# Altium schematic sheet peripherals.SchDoc: Arduino_Peripherals
size A4; DocumentNumber: 3; SheetNumber: 3; SheetTotal: 3
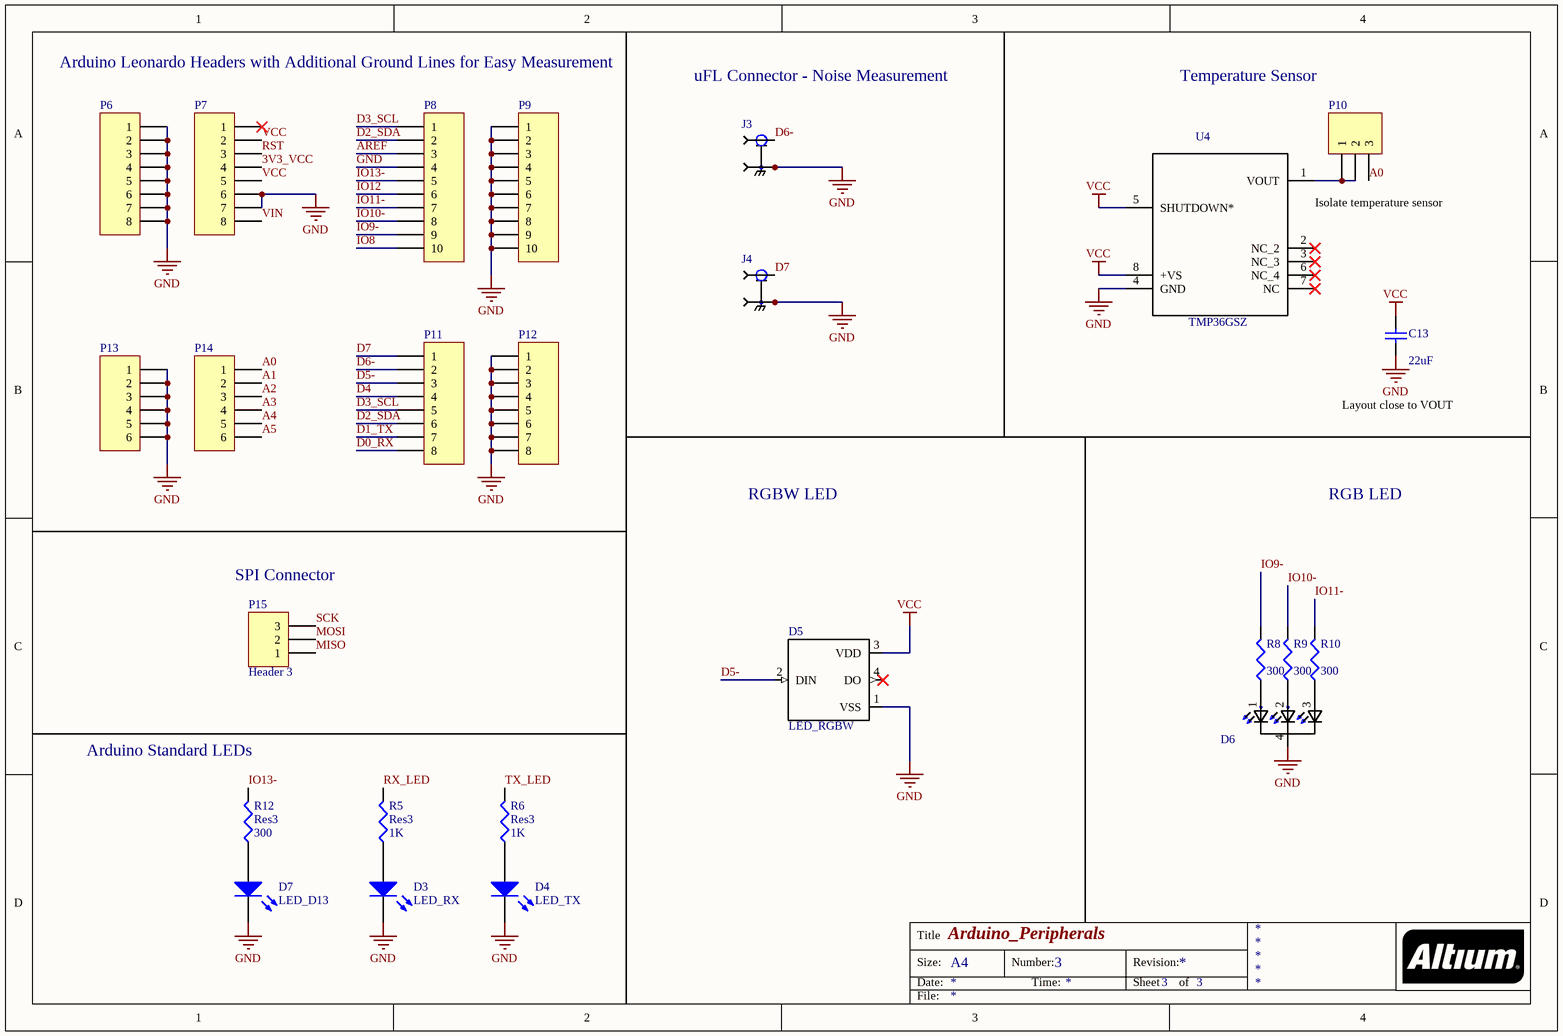
[diagram p0: peripherals.SchDoc]

## Parts
C13  value 22uF  [C1206]  (hidden comment: Cap Semi)
D3  LED_RX  [3.2X1.6X1.1]
D4  LED_TX  [3.2X1.6X1.1]
D5  LED_RGBW  [*LED_IN-PI554FCH]
D6  LED_RGB  [*LED_ASMB-KTF0-0A306]  (value not drawn)
D7  LED_D13  [3.2X1.6X1.1]
J3  U.FL-R-SMT(10)  [*TE_HRS_U.FL-R-SMT(10)]  (value not drawn)
J4  U.FL-R-SMT(10)  [*TE_HRS_U.FL-R-SMT(10)]  (value not drawn)
P6  GND  [HDR1X8]  (value not drawn)
P7  P4  [HDR1X8]  (value not drawn)
P8  P1  [HDR1X10]  (value not drawn)
P9  GND  [HDR1X10]  (value not drawn)
P10  NC A0  [HDR1X3]  (value not drawn)
P11  P2  [HDR1X8]  (value not drawn)
P12  GND  [HDR1X8]  (value not drawn)
P13  GND  [HDR1X6]  (value not drawn)
P14  P3  [HDR1X6]  (value not drawn)
P15  Header 3  [HDR1X3]
R5  Res3  value 1K  [C1206]
R6  Res3  value 1K  [C1206]
R8  value 300  [C1206]  (hidden comment: Res3)
R9  value 300  [C1206]  (hidden comment: Res3)
R10  value 300  [C1206]  (hidden comment: Res3)
R12  Res3  value 300  [C1206]
U4  TMP36GSZ  [*SOIC127P600X175-8N]

## Nets
GND: C13.1 D3.2(K) D4.2(K) D5.1(VSS) D6.4(C) D7.2(K) J3.2(GND) J3.3(GND) J4.2(GND) J4.3(GND) P6.1 P6.2 P6.3 P6.4 P6.5 P6.6 P6.7 P6.8 P7.6 P7.7 P8.4 P9.1 P9.2 P9.3 P9.4 P9.5 P9.6 P9.7 P9.8 P9.9 P9.10 P12.1 P12.2 P12.3 P12.4 P12.5 P12.6 P12.7 P12.8 P13.1 P13.2 P13.3 P13.4 P13.5 P13.6 U4.4(GND)
VCC: C13.2 D5.3(VDD) P7.2 P7.5 U4.5(SHUTDOWN*) U4.8(+VS)
3V3_VCC: P7.4
A0: P10.3 P14.1
A1: P14.2
A2: P14.3
A3: P14.4
A4: P14.5
A5: P14.6
AREF: P8.3
D0_RX: P11.8
D1_TX: P11.7
D2_SDA: P8.2 P11.6
D3_SCL: P8.1 P11.5
D4: P11.4
D5-: D5.2(DIN) P11.3
D6-: J3.1(SIG) P11.2
D7: J4.1(SIG) P11.1
IO8: P8.10
IO9-: P8.9 R8.2
IO10-: P8.8 R9.2
IO11-: P8.7 R10.2
IO12: P8.6
IO13-: P8.5 R12.2
MISO: P15.1
MOSI: P15.2
RST: P7.3
RX_LED: R5.2
SCK: P15.3
TX_LED: R6.2
VIN: P7.8
NetD3_1: D3.1(A) R5.1
NetD4_1: D4.1(A) R6.1
NetD6_1: D6.1(R) R8.1
NetD6_2: D6.2(G) R9.1
NetD6_3: D6.3(B) R10.1
NetD7_1: D7.1(A) R12.1
NetP10_1: P10.1 P10.2 U4.1(VOUT)

Not connected (* = marked no-connect by the designer): D5 4(DO)*; P7 1*; U4 2(NC_2)* 3(NC_3)* 6(NC_4)* 7(NC)*

## Notes on the sheet
- Arduino Leonardo Headers with Additional Ground Lines for Easy Measurement
- uFL Connector - Noise Measurement
- Temperature Sensor
- Isolate temperature sensor
- Layout close to VOUT
- RGBW LED
- RGB LED
- (near P15) SPI Connector
- (near R12) Arduino Standard LEDs
- Title
- Size:
- Date:
- A4
- Number:
- Time:
- Revision:
- Sheet
- of
- File:

## Library data of the parts
C13 = Cap Semi: Capacitor (Semiconductor SIM Model); Published: 8-Jun-2000; LatestRevisionDate: 29-May-2009; LatestRevisionNote: IPC-7351 Footprint Added.; PackageReference: C1206; Publisher: Altium Limited; PackageDescription: Chip Capacitor; DigiKeyPartNo: 1276-3300-1-ND
D3 D4 D7 = LED2: Typical RED, GREEN, YELLOW, AMBER GaAs LED; Published: 8-Jun-2000; LatestRevisionDate: 17-Jul-2002; LatestRevisionNote: Re-released for DXP Platform.; PackageVersion: Feb-2002; PackageReference: 3.2X1.6X1.1; Publisher: Altium Limited; PackageDescription: SM LED; 2 Flat Leads
D5 = IN-PI554FCH: 5050RGB with integrated IC built in 4 PIN Â•Viewing angle: 120 degrees; MF: Inolux; Availability: Unavailable; Price: None; MP: IN-PI554FCH; Package: SMD-4 Innolux; SnapEDA_Link: https://www.snapeda.com/parts/IN-PI554FCH/Inolux/view-part/?ref=snap; Value: *; DigiKeyPartNo: 1830-1209-1-ND
D6 = ASMB-KTF0-0A306: 2220 Tricolor PLCC4 Surface Mount LED; MP: XZM2CRKM2DGFBB45SCCB; MF: SunLED; Availability: Unavailable; Price: None; Package: PLCC-4 Broadcom; SnapEDA_Link: https://www.snapeda.com/parts/ASMB-KTF0-0A306/Broadcom%20Limited/view-part/?ref=snap; Value: *; DigiKeyPartNo: 1497-1225-1-ND
J3 J4 = U.FL-R-SMT(10): U.FL Series 50 Ohm Receptacle Male Pins Ultra Small SMT Coaxial Connector; MF: Hirose; MP: U.FL-R-SMT_10_; Price: None; Package: FakePackage u; SnapEDA_Link: https://www.snapeda.com/parts/U.FL-R-SMT%2810%29/Hirose%20Electric%20Co%20Ltd/view-part/?ref=snap; Availability: Unavailable; Value: *
P6 P7 P11 P12 = Header 8: Header, 8-Pin; LatestRevisionDate: 17-Jul-2002; LatestRevisionNote: Re-released for DXP Platform.; Publisher: Altium Limited
P8 P9 = Header 10: Header, 10-Pin; LatestRevisionDate: 17-Jul-2002; LatestRevisionNote: Re-released for DXP Platform.; Publisher: Altium Limited
P10 P15 = Header 3: Header, 3-Pin; LatestRevisionDate: 17-Jul-2002; LatestRevisionNote: Re-released for DXP Platform.; Publisher: Altium Limited
P13 P14 = Header 6: Header, 6-Pin; LatestRevisionDate: 17-Jul-2002; LatestRevisionNote: Re-released for DXP Platform.; Publisher: Altium Limited
R5 R6 R8-R10 R12 = Res3: Resistor; Published: 8-Jun-2000; LatestRevisionDate: 29-May-2009; LatestRevisionNote: IPC-7351 Footprint Added.; PackageReference: J1-0603; Publisher: Altium Limited; PackageDescription: Chip Resistor
U4 = TMP36GSZ: Temp Sensor Analog_Voltage_ Serial _2-Wire_ 8-Pin SOIC N Tube; MF: Analog Devices; Package: SOIC-8 Analog Devices; MP: TMP36GSZ; Price: None; SnapEDA_Link: https://www.snapeda.com/parts/TMP36GSZ/Analog%20Devices%20Inc./view-part/?ref=snap; Availability: Unavailable; Value: *